# EAGLE design RH018.1 (EAGLE 7.1.0)
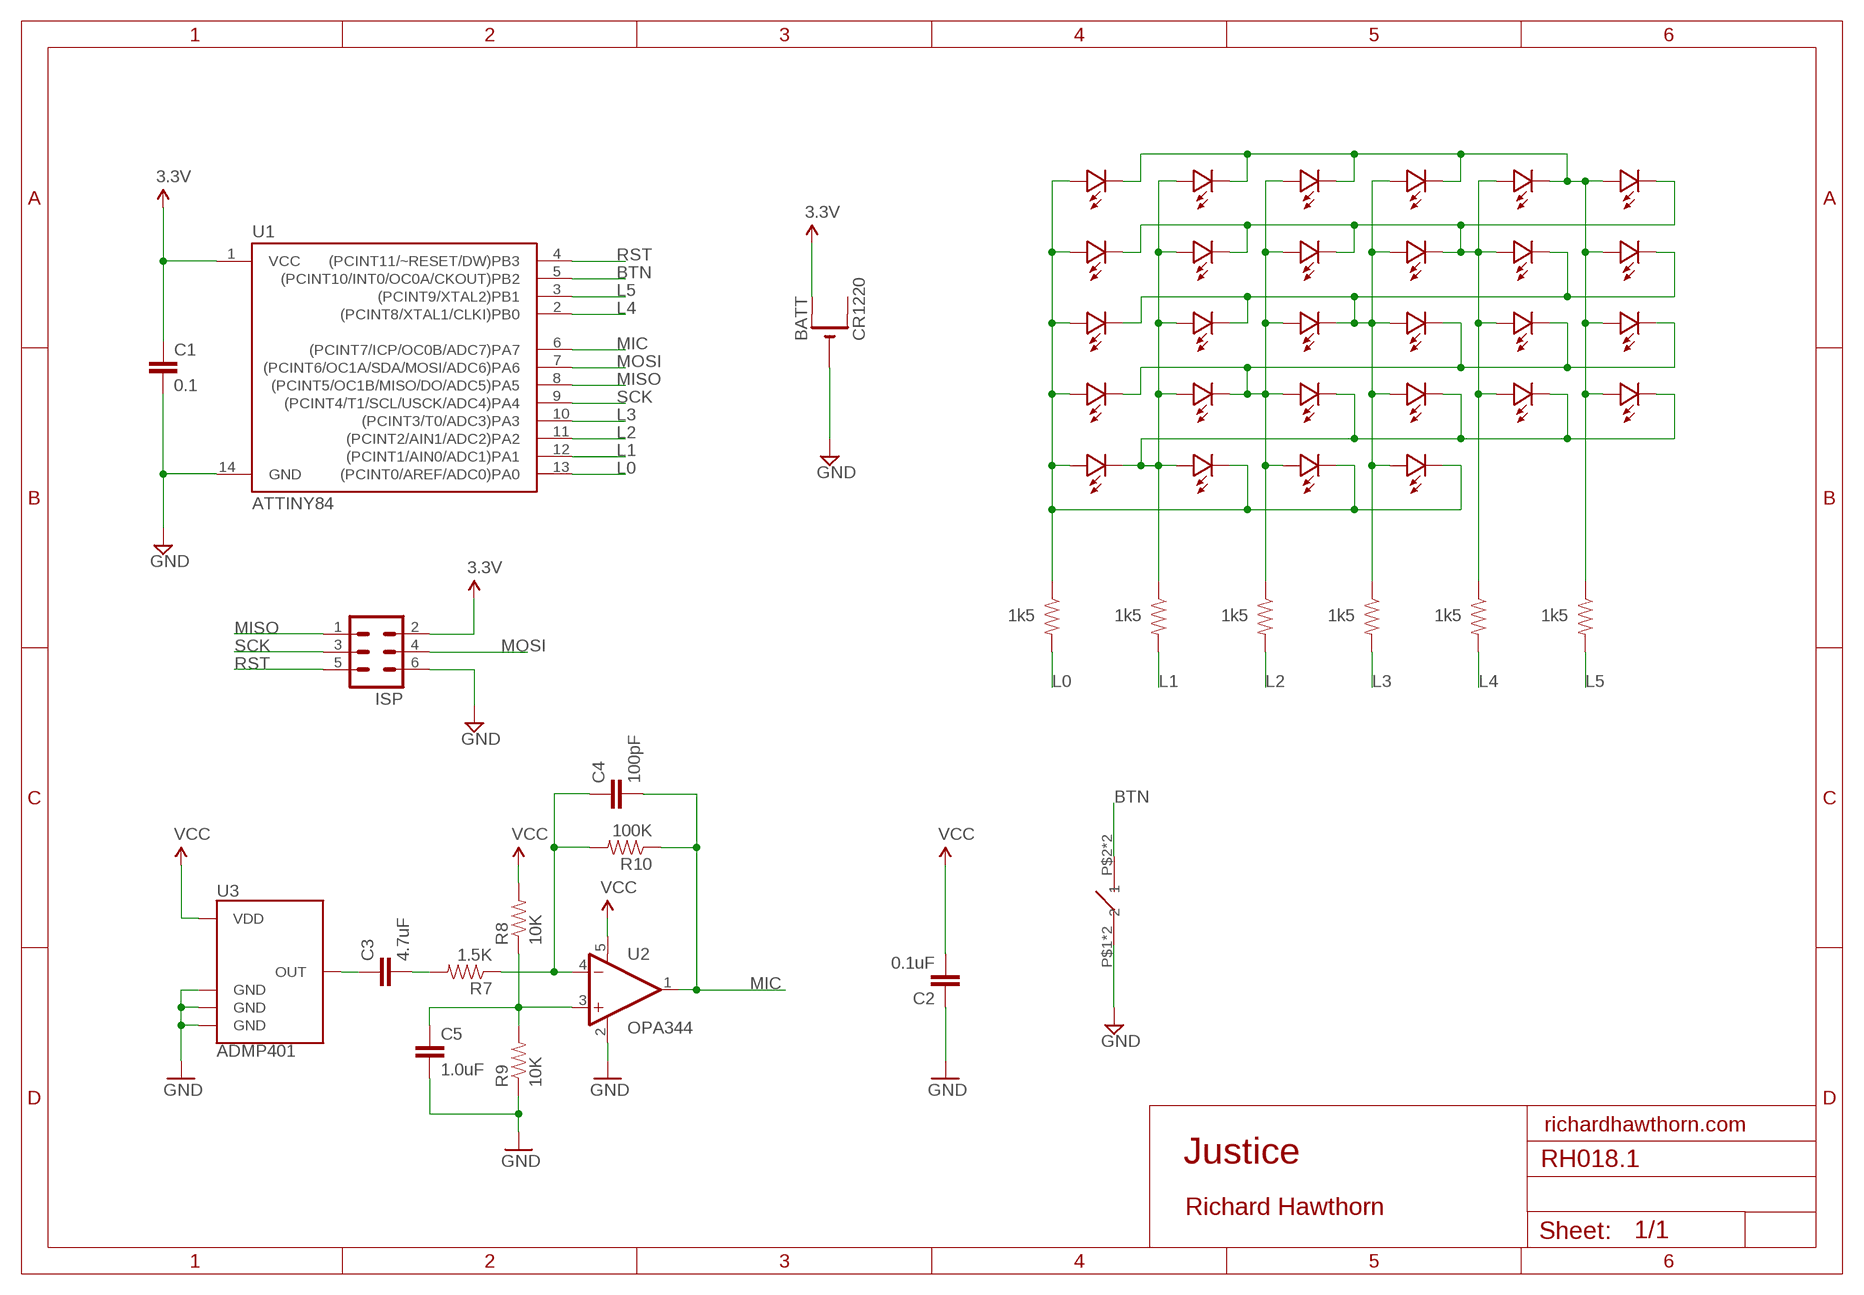
[diagram p0: schematic, sheet 1]

## Parts
BATT  CR1220  CR1220SMT  [CR1220-SMD]
BTN1  TURTLE-3PIN  [TURTLE-3PIN]
C1  0.1  CAP0603-CAP  [0603-CAP]
C2  0.1uF  CAP0402-CAP  [0402-CAP]
C3  4.7uF  CAP0402-CAP  [0402-CAP]
C4  100pF  CAP0402-CAP  [0402-CAP]
C5  1.0uF  CAP0402-CAP  [0402-CAP]
ISP  MA03-2  [MA03-2]
LED1  LED0603  [0603-LED]
LED2  LED0603  [0603-LED]
LED3  LED0603  [0603-LED]
LED4  LED0603  [0603-LED]
LED5  LED0603  [0603-LED]
LED6  LED0603  [0603-LED]
LED7  LED0603  [0603-LED]
LED8  LED0603  [0603-LED]
LED9  LED0603  [0603-LED]
LED10  LED0603  [0603-LED]
LED11  LED0603  [0603-LED]
LED12  LED0603  [0603-LED]
LED13  LED0603  [0603-LED]
LED14  LED0603  [0603-LED]
LED15  LED0603  [0603-LED]
LED16  LED0603  [0603-LED]
LED17  LED0603  [0603-LED]
LED18  LED0603  [0603-LED]
LED19  LED0603  [0603-LED]
LED20  LED0603  [0603-LED]
LED21  LED0603  [0603-LED]
LED22  LED0603  [0603-LED]
LED23  LED0603  [0603-LED]
LED24  LED0603  [0603-LED]
LED25  LED0603  [0603-LED]
LED26  LED0603  [0603-LED]
LED27  LED0603  [0603-LED]
LED28  LED0603  [0603-LED]
R1  1k5  RESISTOR0603-RES  [0603-RES]
R2  1k5  RESISTOR0603-RES  [0603-RES]
R3  1k5  RESISTOR0603-RES  [0603-RES]
R4  1k5  RESISTOR0603-RES  [0603-RES]
R5  1k5  RESISTOR0603-RES  [0603-RES]
R6  1k5  RESISTOR0603-RES  [0603-RES]
R7  1.5K  RESISTOR0402-RES  [0402-RES]
R8  10K  RESISTOR0402-RES  [0402-RES]
R9  10K  RESISTOR0402-RES  [0402-RES]
R10  100K  RESISTOR0402-RES  [0402-RES]
U1  ATTINY84  [SO14]
U2  OPA344  [SOT23-5]
U3  ADMP401  [ADMP401]

## Nets
BTN: BTN1.P$2 BTN1.P$4 U1.5((PCINT10/INT0/OC0A/CKOUT)PB2)
C7N$1: C3.1 U3.1(OUT)
GND [power]: BATT.- BTN1.P$1 BTN1.P$3 C1.2 C2.1 C5.2 ISP.6 R9.1 U1.14(GND) U2.2(V-) U3.2(GND) U3.4(GND) U3.6(GND)
L0: R1.2 U1.13((PCINT0/AREF/ADC0)PA0)
L1: R2.2 U1.12((PCINT1/AIN0/ADC1)PA1)
L2: R3.2 U1.11((PCINT2/AIN1/ADC2)PA2)
L3: R4.2 U1.10((PCINT3/T0/ADC3)PA3)
L4: R5.2 U1.2((PCINT8/XTAL1/CLKI)PB0)
L5: R6.2 U1.3((PCINT9/XTAL2)PB1)
MIC: C4.2 R10.1 U1.6((PCINT7/ICP/OC0B/ADC7)PA7) U2.1(OUT)
MISO: ISP.1 U1.8((PCINT5/OC1B/MISO/DO/ADC5)PA5)
MOSI: ISP.4 U1.7((PCINT6/OC1A/SDA/MOSI/ADC6)PA6)
N$2: C4.1 R7.1 R10.2 U2.4(-IN)
N$6: C3.2 R7.2
N$7: C5.1 R8.1 R9.2 U2.3(+IN)
N$8: LED1.MINUS LED2.MINUS LED3.MINUS LED4.MINUS LED5.MINUS LED6.PLUS LED12.PLUS LED18.PLUS LED24.PLUS R6.1
N$12: LED2.PLUS LED8.PLUS LED14.PLUS LED20.PLUS LED21.MINUS LED22.MINUS LED23.MINUS LED24.MINUS LED25.MINUS LED26.PLUS R2.1
N$22: LED1.PLUS LED7.PLUS LED13.PLUS LED19.PLUS LED25.PLUS LED26.MINUS LED27.MINUS LED28.MINUS R1.1
N$32: LED5.PLUS LED6.MINUS LED7.MINUS LED8.MINUS LED9.MINUS LED10.MINUS LED11.PLUS LED17.PLUS LED23.PLUS R5.1
N$41: LED4.PLUS LED10.PLUS LED11.MINUS LED12.MINUS LED13.MINUS LED14.MINUS LED15.MINUS LED16.PLUS LED22.PLUS LED28.PLUS R4.1
N$50: LED3.PLUS LED9.PLUS LED15.PLUS LED16.MINUS LED17.MINUS LED18.MINUS LED19.MINUS LED20.MINUS LED21.PLUS LED27.PLUS R3.1
RST: ISP.5 U1.4((PCINT11/~RESET/DW)PB3)
SCK: ISP.3 U1.9((PCINT4/T1/SCL/USCK/ADC4)PA4)
VCC: BATT.+$1(+) C1.1 C2.2 ISP.2 R8.2 U1.1(VCC) U2.5(V+) U3.5(VDD) ; supply symbol labelled 3.3V
Unconnected: BATT.+$2(+1)

## Notes on the sheet
- richardhawthorn.com
- Justice
- Richard Hawthorn

## Library data of the parts
BATT = adafruit:CR1220: CR1216/CR1220/CR1225 12mm 3V lithium coin cell Great for battery packup. Both SMT and THM holders. Note the THM package has the ground pads on both sides of the PCB so that the masks are the same - this reduces the cost
BTN1 = Richards:TURTLE-3PIN
C1 = LowPowerLab:CAP: Capacitor Standard 0603 ceramic capacitor, and 0.1" leaded capacitor.
C2-C5 = SparkFun:CAP: Capacitor Standard 0603 ceramic capacitor, and 0.1" leaded capacitor.
ISP = Richards:MA03-2: PIN HEADER; OC_FARNELL: unknown; OC_NEWARK: unknown
LED1-LED28 = LowPowerLab:LED
R1-R6 = LowPowerLab:RESISTOR: Resistor
R7-R10 = SparkFun:RESISTOR: Resistor
U1 = SparkFun-DigitalIC:ATTINY84: Atmel 14-pin 2/4/8kB flash uC
U2 = SparkFun:OPA344
U3 = SparkFun:ADMP401

## Net classes
1 power: width 0.381 mm, clearance 0.254 mm

## Board
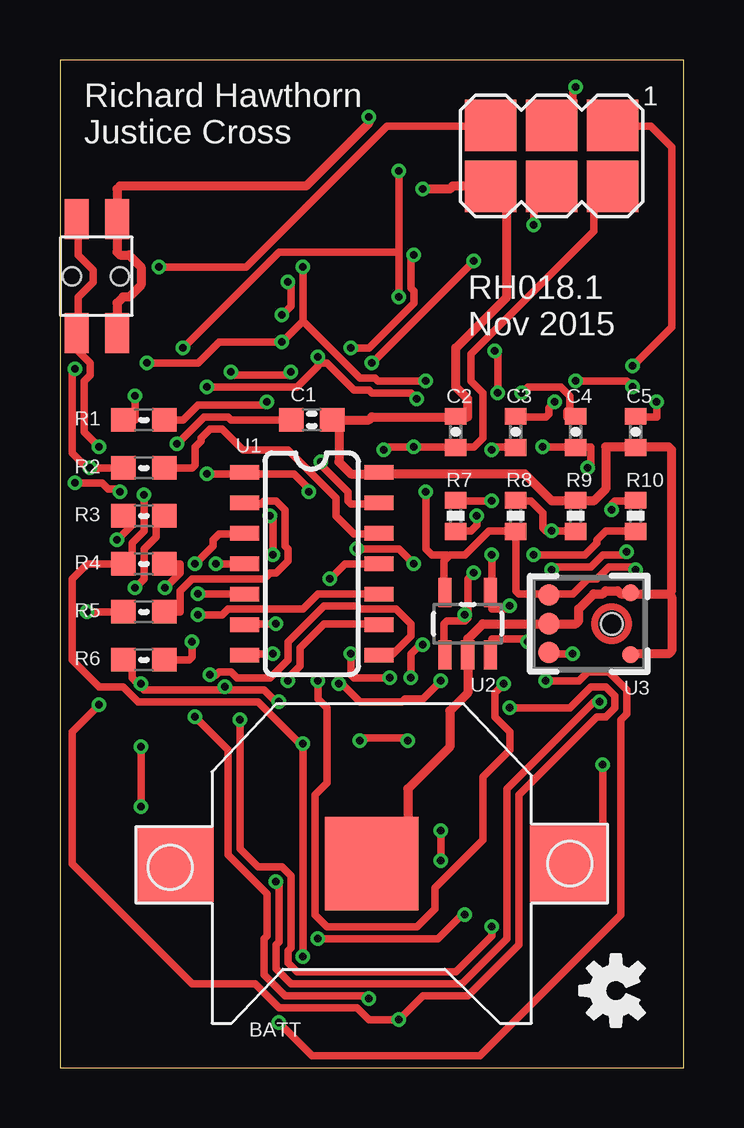
[diagram p1: board, top side]
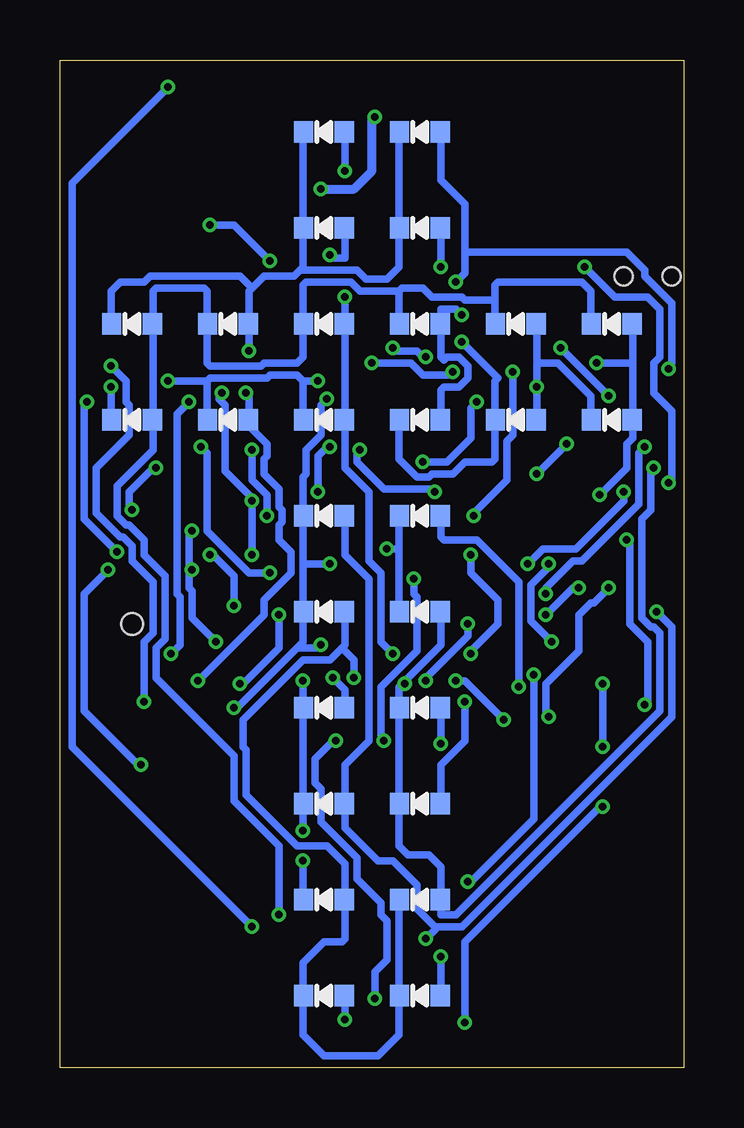
[diagram p2: board, bottom side, seen from below]

Size 26 x 42 mm. Coordinates in mm from the lower left corner, seen from the top.
Outline: 26,0 26,42 0,42 0,0 26,0
Copper layers (1*16): Top 0.035mm / dielectric 1.5mm / Bottom 0.035mm
Design rules "ITEADstudio_DRC *": minimum track width 12mil, minimum drill 12mil, track to track 6mil, track to pad 6mil, pad to pad 6mil, via to via 6mil, smd to smd 0mil, copper to edge 10mil, drill to drill 10mil, minimum pad ring 10mil, minimum via ring 6mil, stop-mask expansion 2mil, vias tented up to drill 100mil, thermal gap 15mil
tRestrict: area 24.3,8.9 to 29.1,12.8; area 5.8,16.9 to 6.9,18.5; area 5.2,9.7 to 6.7,10.4
bRestrict: area 27.4,17.7 to 29.2,18.7; area 21.1,13.8 to 22.9,14.9; area 21.6,12.6 to 22.1,13.2; area 20.7,12.6 to 21.2,13.2; area 20.2,12.8 to 20.7,13.5; area 20.1,13.4 to 20.6,14; area 26.5,18.9 to 27.1,19.5; area 26.5,17.9 to 27.1,18.5; area 27.5,19.1 to 28,19.8; area 27.9,18.8 to 29.1,19.6

### Footprints (pad centres in the part's own frame; a part is rotated, then mirrored left to right if it is on the bottom)
CR1220-SMD = smd 3.2 x 3.2: +$1 -8.2,0; +$2 8.2,0 | smd 3.9 x 3.9: - 0,0
TURTLE-3PIN = smd 1.676 x 1: P$1 -2.39,-0.889; P$2 -2.39,0.811; P$3 2.36,-0.889; P$4 2.36,0.811 | hole 0.75: -0.015,-1; -0.015,1
0603-CAP = smd 1.016 x 0.965: 1 -0.85,0; 2 0.85,0
0402-CAP = smd 0.7 x 0.9: 1 -0.65,0; 2 0.65,0
MA03-2 = smd 2.159 x 2.159: 1 -2.54,-1.27; 2 -2.54,1.27; 3 0,-1.27; 4 0,1.27; 5 2.54,-1.27; 6 2.54,1.27
0603-LED = smd 0.8 x 0.9: MINUS -0.85,0; PLUS 0.85,0
0603-RES = smd 1.016 x 0.965: 1 -0.85,0; 2 0.85,0
0402-RES = smd 0.7 x 0.9: 1 -0.65,0; 2 0.65,0
SO14 = smd 0.6 x 1.2: 1 -3.81,-2.8; 2 -2.54,-2.8; 3 -1.27,-2.8; 4 0,-2.8; 5 1.27,-2.8; 6 2.54,-2.8; 7 3.81,-2.8; 8 3.81,2.8; 9 2.54,2.8; 10 1.27,2.8; 11 0,2.8; 12 -1.27,2.8; 13 -2.54,2.8; 14 -3.81,2.8
SOT23-5 = smd 0.55 x 1.2: 1 -0.95,-1.3; 2 0,-1.3; 3 0.95,-1.3; 4 0.95,1.3; 5 -0.95,1.3
ADMP401 = smd 0.9 x 0.9: 1 -1.2,2.62; 5 1.2,2.62; 6 0,2.62 | smd 0.7 x 0.7: 2 1.3,-0.8; 4 -1.3,-0.8 | hole 0.9: 0,0

### Placement (x,y rotation side)
BATT  13,8.5 180 top
BTN1  1.5,33 90 top
C1  10.5,27 0 top
C2  16.5,26.5 270 top
C3  19,26.5 270 top
C4  21.5,26.5 270 top
C5  24,26.5 270 top
ISP  20.5,38 180 top
LED1  15,39 0 bottom
LED2  11,39 0 bottom
LED3  15,35 0 bottom
LED4  11,35 0 bottom
LED5  23,31 0 bottom
LED6  19,31 0 bottom
LED7  15,31 0 bottom
LED8  11,31 0 bottom
LED9  7,31 0 bottom
LED10  3,31 0 bottom
LED11  23,27 0 bottom
LED12  19,27 0 bottom
LED13  15,27 0 bottom
LED14  11,27 0 bottom
LED15  7,27 0 bottom
LED16  3,27 0 bottom
LED17  15,23 0 bottom
LED18  11,23 0 bottom
LED19  15,19 0 bottom
LED20  11,19 0 bottom
LED21  15,15 0 bottom
LED22  11,15 0 bottom
LED23  15,11 0 bottom
LED24  11,11 0 bottom
LED25  15,7 0 bottom
LED26  11,7 0 bottom
LED27  15,3 0 bottom
LED28  11,3 0 bottom
R1  3.5,27 0 top
R2  3.5,25 0 top
R3  3.5,23 0 top
R4  3.5,21 0 top
R5  3.5,19 0 top
R6  3.5,17 0 top
R7  16.5,23 270 top
R8  19,23 270 top
R9  21.5,23 270 top
R10  24,23 270 top
U1  10.5,21 270 top
U2  17,18.5 0 top
U3  23,18.5 90 top
U$3  [OSHW-LOGO-S]  23.17,3.21 90 top

### Tracks (layer width: path | path; a pad name or v marks a point on that pad's centre or on a via)
BTN  (via drill 0.3)
  Top 0.305: BTN1.P$4 0.75,35.25 0.75,33.88 1.38,33.25 1.38,32.75 0.75,32.12 0.75,30.62 BTN1.P$2 0.75,30.5 0.75,29.88 1.25,29.38 1.25,28.88 1,28.62 1,26.5 v1.62,25.88 | v5.75,19.75 7.62,19.75 U1.5
  Bottom 0.305: v5.75,19.75 5.75,20 4.62,21.12 4.25,21.12 1.88,23.5 1.88,25.62 v1.62,25.88
C7N$1  (via drill 0.3)
  Top 0.305: v20.62,27.75 20.38,27.5 20.38,27.25 20.25,27.12 19,27.12 C3.1 | v21.38,17.25 20.5,17.25 U3.1
  Bottom 0.305: v20.62,27.75 21.12,27.25 21.12,19.75 21,19.62 21,17.62 v21.38,17.25
GND  (via drill 0.3)
  Top 0.381: BTN1.P$1 2.38,30.62 2.38,31.88 2.62,32.12 2.88,32.12 3.38,32.62 3.38,33.38 2.88,33.88 2.5,33.88 2.38,34 2.38,35.25 BTN1.P$3 2.38,35.5 2.38,36.62 2.5,36.75 10.25,36.75 12.88,39.38 v12.88,39.62 | v15.12,36.62 16.25,36.62 16.38,36.75 17.88,36.75 ISP.6 18,36.75 18.62,36.75 18.62,32.12 16.5,30 16.5,28.38 17,27.88 17,27.12 16.62,27.12 C2.1 16.5,27.12 13,27.12 12.88,27 C1.2 11.62,26.88 11.62,25.25 12.12,24.75 13.25,24.75 U1.14 13.38,24.75 19.38,24.75 20.5,23.62 21.38,23.62 R9.1 21.5,23.62 22.25,23.62 22.75,24.12 22.75,25.88 24,25.88 C5.2 24.12,25.88 25.38,25.88 25.5,25.75 25.5,19.88 25.38,19.75 | 25.38,19.75 25.5,19.62 25.5,17.38 25.38,17.25 23.88,17.25 U3.4 | 25.38,19.75 23.88,19.75 U3.2 23.62,19.75 23.38,19.75 23.25,19.88 22.75,19.88 22.62,19.75 22.25,19.75 21.62,19.12 21.62,18.62 21.5,18.5 U3.6 17.62,18.5 17,17.88 U2.2 17,15.62 16.25,14.88 16.25,13.38 14.5,11.62 14.5,8.62 14.38,8.5 BATT.-
  Bottom 0.381: v12.88,39.62 13,39.5 13,37.38 13.75,36.62 v15.12,36.62
L0  (via drill 0.3)
  Top 0.305: v10.88,25.25 10.88,25.12 12,24 12,23.62 12.12,23.5 13.25,23.5 U1.13 | v8.62,27.75 8.5,27.62 5.75,27.62 5.12,27 R1.2
  Bottom 0.305: v10.88,25.25 9.88,25.25 8.88,26.25 8.88,27.5 v8.62,27.75
L1
  Top 0.305: R2.2 5.5,25 5.62,25.12 5.62,25.88 5.88,26.12 5.88,26.25 6.25,26.62 6.75,26.62 7.62,25.75 9.5,25.75 11.5,23.75 11.5,23 12.25,22.25 13.25,22.25 U1.12
L2  (via drill 0.3)
  Top 0.305: U1.11 11.88,21 v11.25,20.38 | v12.5,13.62 12.62,13.75 14.38,13.75 v14.5,13.62 | v12.88,2.88 12.75,3 9.38,3 8.5,3.88 8.5,5.38 8.62,5.5 8.62,7.25 7,8.88 7,13.25 v5.62,14.62 | v3.12,20 3.5,20.38 3.5,21.62 4,22.12 4,23 R3.2
  Bottom 0.305: v11.25,20.38 11.25,19.75 11.12,19.62 11.12,17.38 12.62,15.88 12.62,13.75 v12.5,13.62 | v14.5,13.62 14.62,13.62 15.38,12.88 15.38,11.88 15.12,11.62 15.12,10.25 13.62,8.75 13.62,7.88 12.62,6.88 12.62,6.38 12.38,6.12 12.38,4.5 12.88,4 v12.88,2.88 | v5.62,14.62 5.75,14.75 5.75,16 4.38,17.38 4.38,18.88 3.88,19.38 3.75,19.38 v3.12,20
L3  (via drill 0.3)
  Top 0.305: R4.2 5,21 5,20.62 v4.38,20 | v5.75,18.88 6.75,18.88 7,19.12 10.12,19.12 10.75,19.75 13.25,19.75 U1.10
  Bottom 0.305: v4.38,20 4.62,20 v5.75,18.88
L4
  Top 0.305: R5.2 5,19 5,19.88 5.5,20.38 8.5,20.38 8.75,20.62 9,20.62 9.5,21.12 9.5,21.62 9.38,21.75 9.38,23.25 9,23.62 8.5,23.62 8.38,23.5 7.75,23.5 U1.2
L5  (via drill 0.3)
  Top 0.305: v5.62,21 6.38,21.75 6.38,22 6.62,22.25 7.62,22.25 U1.3 | v5.5,17.75 5.5,17.12 5.38,17 R6.2
  Bottom 0.305: v5.62,21 5.62,20.88 6.38,20.12 6.38,18.62 v5.5,17.75
MIC  (via drill 0.3)
  Top 0.305: v23,23.25 23,23.5 23.12,23.62 24,23.62 R10.1 | v22,25 22.12,25.12 22.12,25.88 21.5,25.88 C4.2 21.38,25.88 v20.12,25.88 | 17,18.88 17,20.38 v17.25,20.62 | 17,18.88 17,18.75 16.88,18.62 16.12,18.62 16,18.5 16,17.25 U2.1 | v9,18.5 7.75,18.5 U1.6 | v10.75,16.12 10.75,15.38 11.12,15 11.12,11.88 10.62,11.38 10.62,6.38 11.12,5.88 14.88,5.88 15.62,6.62 15.62,7.5 17.62,9.5 17.62,12.12 18.75,13.25 18.75,14 18.12,14.62 18.12,15.62 v18.5,16 | v16.88,18.88 17,18.88
  Bottom 0.305: v23,23.25 23.12,23.38 23.12,24 22.12,25 v22,25 | v17.25,20.62 18.12,20.62 19.88,22.38 19.88,25.62 v20.12,25.88 | v9,18.5 9,18 10.75,16.25 v10.75,16.12 | v18.5,16 18.38,16 16.88,17.5 v16.88,18.88
MISO  (via drill 0.3)
  Top 0.305: v23.88,29.25 25.5,30.88 25.5,38.38 24.62,39.25 23.12,39.25 ISP.1 | v22.5,15.25 22.25,15.25 18.62,11.62 18.62,5.38 16.75,3.5 9.62,3.5 9,4.12 9,5.12 9.12,5.25 9.12,7.62 v9,7.75 | v6.25,16.38 6.5,16.38 6.62,16.5 7.12,16.5 7.38,16.25 8.75,16.25 9.5,17 9.5,17.75 11,19.25 12.38,19.25 12.5,19.12 14,19.12 14.62,18.5 14.62,18 13.88,17.25 13.38,17.25 U1.8
  Bottom 0.305: v23.88,29.25 23.25,28.62 23.25,27.75 23.12,27.62 23.12,26.38 24.5,25 24.5,23.12 23.5,22.12 23.38,22.12 23,21.75 23,21.12 22.12,20.25 22.12,18.12 22.5,17.75 v22.5,15.25 | v9,7.75 8.88,7.75 6.25,10.38 v6.25,16.38
MOSI  (via drill 0.3)
  Top 0.305: v19.75,35.12 19.75,36.75 20.5,36.75 ISP.4 | v13,29.38 v17.25,33.62 | v9.62,29 9.5,28.88 7.25,28.88 v7.12,29 | v8.75,23 8.88,22.88 v8.88,21.38 | v8.88,17.25 7.75,17.25 U1.7
  Bottom 0.305: v19.75,35.12 18.75,35.12 v17.25,33.62 | v13,29.38 11.38,29.38 10.88,28.88 9.75,28.88 v9.62,29 | v7.12,29 7.12,26.38 7.38,26.12 7.38,24.5 8.75,23.12 v8.75,23 | v8.88,21.38 8.88,20.62 7.75,19.5 7.75,18.5 8.88,17.38 v8.88,17.25
N$2  (via drill 0.3)
  Top 0.305: v18,23.62 16.5,23.62 R7.1 | v18,21.38 18,19.88 U2.4 18,19.75 18,19.12 18.62,19.12 v18.75,19.25 | v19.75,21.38 21.88,21.38 22.38,21.88 22.38,22 22.75,22.38 24,22.38 R10.2 | v19.25,28.12 19.5,28.38 20.88,28.38 21.25,28 21.25,27.5 21.12,27.38 21.12,27.12 21.5,27.12 C4.1
  Bottom 0.305: v18,21.38 v18,23.62 18,23.75 19.12,24.88 19.12,27.62 19.38,27.88 19.38,28 v19.25,28.12 | v19.75,21.38 19.62,21.38 18.75,20.5 v18.75,19.25
N$6  (via drill 0.3)
  Top 0.305: v17.38,23 17.38,22.62 17.12,22.38 16.5,22.38 R7.2 | v18,25.75 18.12,25.88 19,25.88 C3.2
  Bottom 0.305: v17.38,23 17.38,23.88 18,24.5 v18,25.75
N$7  (via drill 0.3)
  Top 0.305: R9.2 21.5,22.38 v20.5,22.38 20.25,22.38 20.12,22.5 20.12,23.12 19.62,23.62 19,23.62 R8.1 | v24.88,27.75 24.88,27.12 24,27.12 C5.1 | v23.62,21.5 23.5,21.38 22.62,21.38 22.12,20.88 20.62,20.88 v20.5,20.75 | v19.5,17.75 19.38,17.88 18,17.88 18,17.25 U2.3
  Bottom 0.305: v24.88,27.75 25,27.62 25,22.88 v23.62,21.5 | v20.5,22.38 20.62,22.25 20.62,20.88 v20.5,20.75 20.62,20.75 20.62,20 20.5,19.88 20.5,18.75 v19.5,17.75
N$8  (via drill 0.3)
  Top 0.305: v9.12,15.25 9,15.25 8.5,15.75 6.88,15.75 | 6.88,15.75 3.5,15.75 3.31,15.94 | 3.31,15.94 3,16.25 3,17 R6.1 | v6.88,15.88 6.88,15.75 | v18.25,28.12 18.25,29.75 v18.12,29.88 | v3.38,10.88 v3.38,13.38 | v9.12,1.88 10.5,0.5 17.5,0.5 23.38,6.38 23.38,14.5 23.62,14.75 23.62,15.75 22.88,16.5 22,16.5 21.62,16.12 v20.25,16.12 | v3.38,16 3.31,15.94
  Bottom 0.305: v9.12,15.25 9.12,13.62 10.12,12.62 10.12,11 LED24.PLUS | v6.88,15.88 6.88,20.25 8.62,22 10,22 10.12,22.12 10.12,23 LED18.PLUS | LED2.MINUS 11.88,39 11.88,35 LED4.MINUS 11.88,34.88 11.88,33.38 12.38,32.88 13.25,32.88 13.62,33.25 15.88,33.25 15.94,33.31 | 18,32.5 17.5,33 16.25,33 15.94,33.31 | 18,32.5 18.12,32.38 18.12,31 LED6.PLUS 18.12,30.88 v18.12,29.88 | 15.94,33.31 15.88,33.38 15.88,35 LED3.MINUS 15.88,35.12 15.88,39 LED1.MINUS | v18.25,28.12 18.12,28 18.12,27 LED12.PLUS 18.12,26.88 18.12,26.75 17.38,26 17.38,25.5 17.5,25.38 17.5,24.75 16.88,24.12 16.88,23.38 16.75,23.25 16.75,22.75 16.88,22.62 16.88,22 16.38,21.5 16.38,20.62 17.5,19.5 17.5,18.88 v20.25,16.12 | 18,32.5 18.5,33 22.25,33 22.5,32.75 23.5,32.75 23.88,32.38 23.88,31 LED5.MINUS | v3.38,13.38 v3.38,16 | v3.38,10.88 3.5,10.88 9.12,5.25 v9.12,1.88
N$12  (via drill 0.3)
  Top 0.305: v15.88,9.88 v15.88,8.62 | v15.88,16.12 15.12,15.38 14.38,15.38 14.25,15.25 12.5,15.25 11.75,16 v11.62,16 | v9.5,32.75 9.62,32.62 9.62,31.75 v9.25,31.38 | R2.1 v1.25,25 1.12,25 0.5,25.62 0.5,29 v0.62,29.12
  Bottom 0.305: v15.88,8.62 15.88,7 LED25.MINUS | v15.88,9.88 15.88,11 LED23.MINUS 15.88,11.12 15.88,15 LED21.MINUS 15.88,15.12 v15.88,16.12 | 11.69,16.06 11.88,15.88 11.88,15 LED22.MINUS 11.88,14.88 11.88,11.12 LED24.MINUS 11.88,11 11.88,9.25 11.5,8.88 10.62,8.88 10.12,8.38 10.12,7 LED26.PLUS 10.12,6.88 10.12,6.38 9.5,6.38 1,14.88 1,18.12 1.25,18.38 1.38,18.38 1.75,18.75 1.75,22.88 1.38,23.25 1.38,24.88 v1.25,25 | 11.69,16.06 10.12,17.62 10.12,19 LED20.PLUS | v11.62,16 11.69,16.06 | LED14.PLUS 10.12,27 10.12,28.25 10,28.38 9.38,28.38 9,28.75 9,29.25 9.38,29.62 9.88,29.62 10,29.5 10.12,29.62 10.12,31 LED8.PLUS 10.12,31.12 10.12,31.62 9.5,31.62 v9.25,31.38 | 9.12,34 9.12,33.12 v9.5,32.75 | 9.12,34 9.12,36 10.12,37 10.12,39 LED2.PLUS | v0.62,29.12 0.62,29.25 0.5,29.38 0.5,31.88 1.62,33 1.62,33.25 2.38,34 9.12,34
N$22  (via drill 0.3)
  Top 0.305: v14.12,32.12 14.12,34 | 14.12,34 v14.12,37.38 | R1.1 3.12,27 v3.12,28 | v5.12,30 9.12,34 14.12,34 | v12.12,17.25 12.12,16.38 12.25,16.25 v13.75,16.25
  Bottom 0.305: v14.12,37.38 14.12,39 LED1.PLUS | v14.12,32.12 14.12,31.12 LED7.PLUS 14.12,31 14.12,27 LED13.PLUS 14.12,26.88 14.12,25 13.12,24 13.12,21.12 12.62,20.62 12.62,17.75 v12.12,17.25 | v5.12,30 v3.12,28 | LED26.MINUS 11.88,7 11.88,3 LED28.MINUS 11.88,2.88 11.88,1.38 12.75,0.5 15,0.5 15.88,1.38 15.88,2.88 LED27.MINUS 15.88,3 15.88,4.38 15,5.25 14.25,5.25 14.12,5.38 14.12,7 LED25.PLUS 14.12,7.12 14.12,8.5 14.88,9.25 16.12,9.25 18.25,11.38 18.25,13.25 18.38,13.38 18.38,14.5 15.88,17 14.75,17 14.25,17.5 | 14.25,17.5 14.12,17.62 14.12,19 LED19.PLUS | v13.75,16.25 13.75,17 14.25,17.5
N$32  (via drill 0.3)
  Top 0.305: v1.12,19 R5.1 | v16.88,6.38 16.75,6.38 15.75,5.38 v10.75,5.38
  Bottom 0.305: 7.88,32 7.88,31 LED9.MINUS | 7.88,32 7.88,32.62 7.75,32.75 4.25,32.75 3.88,32.38 3.88,31 LED10.MINUS | 11.88,32.38 11.88,31 LED8.MINUS | 11.88,32.38 11.75,32.5 10.88,32.5 10.5,32.12 9.25,32.12 9.12,32 7.88,32 | 11.88,32.38 13.5,32.38 13.88,32.75 15.75,32.75 15.88,32.62 15.88,31.12 LED7.MINUS 15.88,31 15.88,29.62 16.12,29.38 17.5,29.38 17.62,29.25 19.75,29.25 19.88,29.38 19.88,31 LED6.MINUS 19.88,31.12 19.88,32.38 20,32.5 22,32.5 22.12,32.38 22.12,31.12 LED5.PLUS 22.12,31 22.12,27 LED11.PLUS 22.12,26.88 22.12,25.75 23.62,24.25 23.62,23 23.25,22.62 23.12,22.62 22.5,22 22.5,21.38 21.62,20.5 21.62,17.88 22,17.5 22,16.25 18.75,13 18.75,11.12 16.88,9.25 v16.88,6.38 | LED17.PLUS 14.12,23 14.12,21.38 13.12,20.38 13.12,13.62 14.12,12.62 14.12,11 LED23.PLUS 14.12,10.88 14.12,10 12.75,8.62 12.12,8.62 11.12,7.62 11.12,6.62 10.38,5.88 | v1.12,19 0.5,18.38 0.5,14.62 9.25,5.88 10.38,5.88 | v10.75,5.38 10.38,5.75 10.38,5.88
N$41  (via drill 0.3)
  Top 0.305: v10.12,4.62 v10.12,13.5 10,13.5 8.25,15.25 3.25,15.25 2.62,15.88 1.62,15.88 0.5,17 0.5,20.38 1.12,21 R4.1 3,21 3,21.88 3.5,22.38 v3.5,23.88 | v23.88,28.38 23.62,28.62 v21.5,28.62 | 10.12,31.12 v10.12,33.38 | 10.12,31.12 v9.25,30.25 6.62,30.25 5.75,29.38 v3.62,29.38 | v15.25,28.62 13.25,28.62 13.12,28.75 12.5,28.75 10.12,31.12
  Bottom 0.305: v10.12,4.62 10.12,3 LED28.PLUS | v10.12,13.5 10.12,15 LED22.PLUS | 15.88,28.62 15.88,27 LED13.MINUS | 15.88,28.62 16.12,28.88 17.25,28.88 17.38,28.75 19.75,28.75 19.88,28.62 | 19.88,28.62 19.88,27 LED12.MINUS | v23.88,28.38 23.88,27 LED11.MINUS | 19.88,28.62 v21.5,28.62 | 2.12,29.38 2.12,31 LED10.PLUS | 2.12,29.38 2.12,27 LED16.PLUS 2.12,26.88 2.12,26.25 2.38,26 2.38,25 v3.5,23.88 | LED14.MINUS 11.88,27 11.88,25.38 11.12,24.62 10.62,24.62 10.5,24.75 9.62,24.75 9.12,25.25 8,25.25 7.88,25.38 7.88,27 LED15.MINUS 7.88,27.12 7.88,28.62 7.75,28.75 v9.25,30.25 | v10.12,33.38 10.12,35 LED4.PLUS | v3.62,29.38 2.12,29.38 | v15.25,28.62 15.88,28.62
N$50  (via drill 0.3)
  Top 0.305: v14.75,33.88 14.62,33.75 14.62,32.5 14.75,32.38 14.75,31.88 12.88,30 v12.12,30 | v6.12,28.38 9.88,28.38 10.75,29.25 v10.75,29.62 10.88,29.38 11.12,29.38 12.25,28.25 12.88,28.25 13,28.12 14.62,28.12 v14.88,27.88 | v18.75,15 21.25,15 22.12,15.88 22.75,15.88 23.12,15.5 23.12,15 22.75,14.62 22.38,14.62 19.12,11.38 19.12,5.12 17,3 15.12,3 v14.12,2 12.88,2 12.38,2.5 9.12,2.5 8.12,3.5 5.5,3.5 0.5,8.5 0.5,14 v1.62,15.12 | v14.62,16.25 14.62,17.25 15,17.62 v15.12,17.62 | R3.1 3,23 3,22.62 v2.38,22 | v12.38,21.62 14.12,21.62 v14.75,21
  Bottom 0.305: 6,29.38 5.25,29.38 3.88,28 3.88,27 LED16.MINUS | 6,29.38 6.12,29.5 6.12,31 LED9.PLUS | LED15.PLUS 6.12,27 v6.12,28.38 6.12,29.38 6,29.38 | v14.75,33.88 14.62,33.75 14.12,33.75 14.12,35 LED3.PLUS | v12.12,30 12,29.88 11.12,29.88 10.88,29.62 v10.75,29.62 | 11.88,21.62 11.88,23 LED18.MINUS | 11.88,21.62 11.88,19 LED20.MINUS | 15.88,21 15.88,19 LED19.MINUS 15.88,18.88 15.88,17.75 16.06,17.56 | 15.88,21 15.88,23 LED17.MINUS 15.88,23.12 15.88,24.62 15.75,24.75 15.75,25.75 15.12,26.38 15.12,27.62 v14.88,27.88 | v14.12,2 14.12,3 LED27.PLUS | v18.75,15 18.62,15 16.06,17.56 | v14.62,16.25 14.12,15.75 14.12,15 LED21.PLUS | v15.12,17.62 15.25,17.5 16,17.5 16.06,17.56 | v2.38,22 2.25,21.88 2.25,18.5 1.5,17.75 1.5,15.25 v1.62,15.12 | v12.38,21.62 11.88,21.62 | 15.88,21 v14.75,21
RST  (via drill 0.3)
  Top 0.305: v4.12,33.38 7.75,33.38 13.62,39.25 17.88,39.25 ISP.5 | v0.62,24.38 1.75,24.38 2,24.12 2.38,24.12 v2.5,24 | U1.4 v6.5,21
  Bottom 0.305: v4.12,33.38 2.88,32.12 1.5,32.12 1,31.62 1,29.62 1.25,29.38 1.25,28.12 0.5,27.38 0.5,24.5 v0.62,24.38 | v2.5,24 2.5,23.62 4.5,21.62 5.88,21.62 v6.5,21
SCK  (via drill 0.3)
  Top 0.305: v9.5,16.12 9.5,16.25 10,16.75 10,17.5 11,18.5 13.25,18.5 U1.9 | v7.5,14.5 7.5,9.12 8.25,8.38 9.25,8.38 9.62,8 9.62,5 9.5,4.88 9.5,4.38 9.88,4 16.5,4 18,5.5 v18,5.88 | v21.5,40.88 21.38,40.75 21.38,39.25 20.5,39.25 ISP.3
  Bottom 0.305: v9.5,16.12 9.12,16.12 v7.5,14.5 | v18,5.88 25.5,13.38 25.5,36.88 v21.5,40.88
VCC  (via drill 0.3)
  Top 0.305: C1.1 7.12,27 7,27.12 6,27.12 v4.88,26 | v6.12,24.75 7.62,24.75 U1.1 7.75,24.75 9.75,24.75 10.38,24.12 v10.38,24 | 16.19,21.31 16.25,21.38 16.88,21.38 17.88,22.38 19,22.38 R8.2 19,19.88 19.12,19.75 20.38,19.75 U3.5 20.5,19.75 21.38,19.75 22,20.38 22.38,20.38 22.88,20.88 23.88,20.88 v24,20.75 | 16.19,21.31 16,21.12 16,19.88 U2.5 | v15.25,24 15.25,21.62 15.5,21.38 16.12,21.38 16.19,21.31 | ISP.2 23,36.75 22.25,36.75 22.25,34.88 17.12,29.75 17.12,28.62 17.62,28.12 17.62,26.25 17.25,25.88 16.62,25.88 C2.2 16.5,25.88 v14.75,25.88 13.62,25.88 v13.5,25.75 | BATT.+$1 22.5,8.5 22.62,8.62 v22.62,12.62
  Bottom 0.305: v6.12,24.75 v4.88,26 | v14.75,25.88 14.88,25.88 15.25,25.5 v15.25,24 | v22.62,12.62 22.75,12.62 25,14.88 25,19.75 v24,20.75 | v10.38,24 10.5,24.12 12.5,24.12 13.62,25.25 13.62,25.62 v13.5,25.75

### Text on the board
tNames: Richard Hawthorn / Justice Cross | RH018.1 / Nov 2015
tDocu: REG